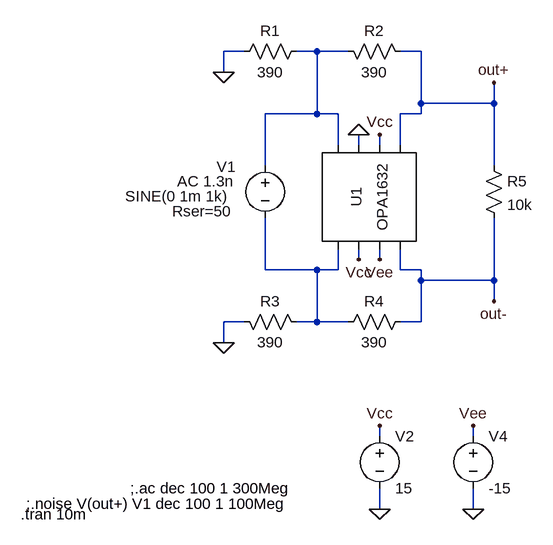
[diagram p0: schematic fully differential.asc]
fully differential.asc, the LTspice schematic file:
Version 4
SHEET 1 880 680
WIRE 32 -160 0 -160
WIRE 144 -160 112 -160
WIRE 192 -160 144 -160
WIRE 304 -160 272 -160
WIRE 0 -128 0 -160
WIRE 304 -80 304 -160
WIRE 416 -80 416 -112
WIRE 416 -80 304 -80
WIRE 144 -64 144 -160
WIRE 144 -64 64 -64
WIRE 176 -64 144 -64
WIRE 304 -64 304 -80
WIRE 304 -64 272 -64
WIRE 176 -16 176 -64
WIRE 208 -16 208 -32
WIRE 240 -16 240 -32
WIRE 272 -16 272 -64
WIRE 64 16 64 -64
WIRE 416 16 416 -80
WIRE 208 160 208 144
WIRE 240 160 240 144
WIRE 64 176 64 96
WIRE 144 176 64 176
WIRE 176 176 176 144
WIRE 176 176 144 176
WIRE 272 176 272 144
WIRE 304 176 272 176
WIRE 304 192 304 176
WIRE 416 192 416 96
WIRE 416 192 304 192
WIRE 416 224 416 192
WIRE 32 256 0 256
WIRE 144 256 144 176
WIRE 144 256 112 256
WIRE 192 256 144 256
WIRE 304 256 304 192
WIRE 304 256 272 256
WIRE 0 288 0 256
WIRE 240 432 240 416
WIRE 384 432 384 416
WIRE 240 544 240 512
WIRE 384 544 384 512
FLAG 240 544 0
FLAG 416 -112 out+
FLAG 416 224 out-
FLAG 240 416 Vcc
FLAG 208 160 Vcc
FLAG 240 -32 Vcc
FLAG 384 544 0
FLAG 384 416 Vee
FLAG 240 160 Vee
FLAG 0 288 0
FLAG 0 -128 0
FLAG 208 -32 0
SYMBOL AutoGenerated\\OPA1632 224 64 M90
SYMATTR InstName U1
SYMBOL voltage 64 0 M0
WINDOW 0 60 33 Bottom 2
WINDOW 3 136 47 Top 2
WINDOW 123 92 55 Bottom 2
WINDOW 39 97 70 Top 2
SYMATTR InstName V1
SYMATTR Value SINE(0 1m 1k)
SYMATTR Value2 AC 1.3n
SYMATTR SpiceLine Rser=50
SYMBOL res 16 -144 R270
WINDOW 0 32 56 VTop 2
WINDOW 3 0 56 VBottom 2
SYMATTR InstName R1
SYMATTR Value 390
SYMBOL res 128 272 M270
WINDOW 0 32 56 VTop 2
WINDOW 3 0 56 VBottom 2
SYMATTR InstName R3
SYMATTR Value 390
SYMBOL res 288 -144 M270
WINDOW 0 32 56 VTop 2
WINDOW 3 0 56 VBottom 2
SYMATTR InstName R2
SYMATTR Value 390
SYMBOL res 288 240 R90
WINDOW 0 0 56 VBottom 2
WINDOW 3 32 56 VTop 2
SYMATTR InstName R4
SYMATTR Value 390
SYMBOL voltage 240 416 R0
WINDOW 123 0 0 Left 2
WINDOW 39 0 0 Left 2
SYMATTR InstName V2
SYMATTR Value 15
SYMBOL voltage 384 416 R0
WINDOW 123 0 0 Left 2
WINDOW 39 0 0 Left 2
SYMATTR InstName V4
SYMATTR Value -15
SYMBOL res 400 0 R0
SYMATTR InstName R5
SYMATTR Value 10k
TEXT -144 512 Left 2 !;.ac dec 100 1 300Meg
TEXT -304 536 Left 2 !;.noise V(out+) V1 dec 100 1 100Meg
TEXT -312 552 Left 2 !.tran 10m

The netlist it stands for:
* fully differential.asc
* U1: OPA1632 (symbol AutoGenerated\OPA1632 not available, pins judged from their places): pin1=N001 pin2=0 pin3=Vcc pin4=out+ pin5=N002 pin6=Vcc pin7=Vee pin8=out-
V1 N001 N002 SINE(0 1m 1k) AC 1.3n Rser=50
R1 0 N001 390
R3 N002 0 390
R2 out+ N001 390
R4 out- N002 390
V2 Vcc 0 15
V4 Vee 0 -15
R5 out+ out- 10k
;.ac dec 100 1 300Meg
;.noise V(out+) V1 dec 100 1 100Meg
.tran 10m
.backanno
.end